# EAGLE design WiFiRadio (EAGLE 9.4.2)
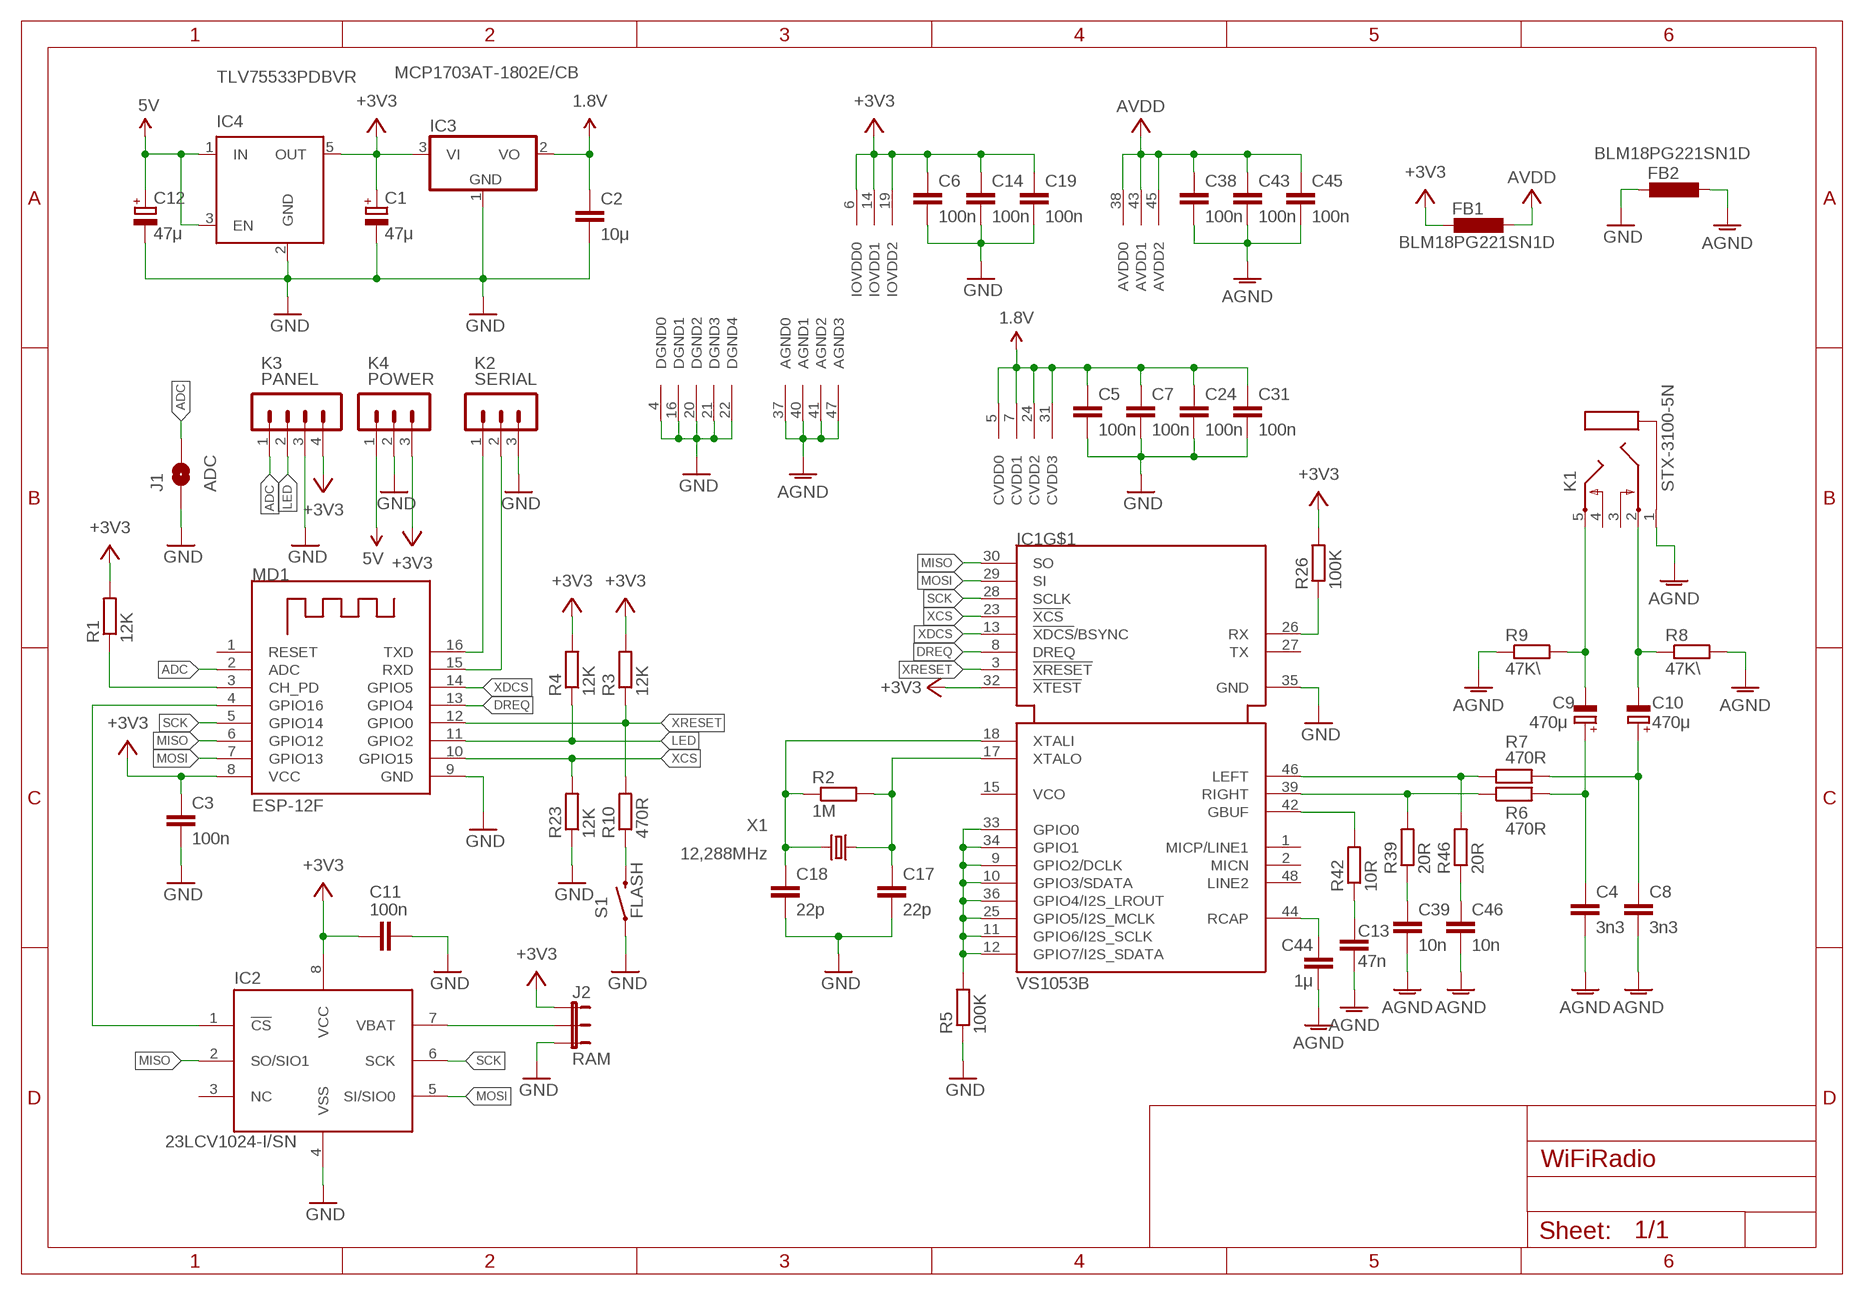
[diagram p0: schematic, sheet 1]

## Parts
C1  47μ  CPOL-EUSMCB  [SMC_B]
C2  10μ  C-EUC0805  [C0805]
C3  100n  C-EUC0603  [C0603]
C4  3n3  C-EUC0805  [C0805]
C5  100n  C-EUC0603  [C0603]
C6  100n  C-EUC0603  [C0603]
C7  100n  C-EUC0603  [C0603]
C8  3n3  C-EUC0805  [C0805]
C9  470μ  CPOL-EUE3.5-8  [E3,5-8]
C10  470μ  CPOL-EUE3.5-8  [E3,5-8]
C11  100n  C-EUC0603  [C0603]
C12  47μ  CPOL-EUSMCB  [SMC_B]
C13  47n  C-EUC0805  [C0805]
C14  100n  C-EUC0603  [C0603]
C17  22p  C-EUC0805  [C0805]
C18  22p  C-EUC0805  [C0805]
C19  100n  C-EUC0603  [C0603]
C24  100n  C-EUC0603  [C0603]
C31  100n  C-EUC0603  [C0603]
C38  100n  C-EUC0603  [C0603]
C39  10n  C-EUC0805  [C0805]
C43  100n  C-EUC0603  [C0603]
C44  1μ  C-EUC0805  [C0805]
C45  100n  C-EUC0603  [C0603]
C46  10n  C-EUC0805  [C0805]
FB1  BLM18PG221SN1D  L-EUL2012C  [L2012C]
FB2  BLM18PG221SN1D  L-EUL2012C  [L2012C]
IC1  VS1053B  [LQFP48]
IC2  23LCV1024-I/SN  [SO-08]
IC3  MCP1703AT-1802E/CB  MCP1703CB  [SOT23]
IC4  TLV75533PDBVR  TLV7555P-DBV  [SOT23-5]
J1  ADC  SOLDERJUMPER-OLDNC  [SJ_2S]
J2  RAM  JUMPER-3SMD  [SJ_3]
K1  STX-3100-5N  STEREOJACK  [STX3100]
K2  SERIAL  MA03-1  [MA03-1]
K3  PANEL  MA04-1  [MA04-1]
K4  POWER  MA03-1  [MA03-1]
MD1  ESP-12F  [ESP-12F]
R1  12K  R-EU_R0805  [R0805]
R2  1M  R-EU_R0805  [R0805]
R3  12K  R-EU_R0805  [R0805]
R4  12K  R-EU_R0805  [R0805]
R5  100K  R-EU_R0805  [R0805]
R6  470R  R-EU_R0805  [R0805]
R7  470R  R-EU_R0805  [R0805]
R8  47K\  R-EU_R0805  [R0805]
R9  47K\  R-EU_R0805  [R0805]
R10  470R  R-EU_R0805  [R0805]
R23  12K  R-EU_R0805  [R0805]
R26  100K  R-EU_R0805  [R0805]
R39  20R  R-EU_R0805  [R0805]
R42  10R  R-EU_R0805  [R0805]
R46  20R  R-EU_R0805  [R0805]
S1  FLASH  SWITCH-MOMENTARY-2SMD  [TACTILE-SWITCH-SMD]
X1  12,288MHz  CRYSTALHC49S  [HC49/S]

## Nets
1.8V: C2.1 C5.1 C7.1 C24.1 C31.1 IC1.5(CVDD0) IC1.7(CVDD1) IC1.24(CVDD2) IC1.31(CVDD3) IC3.2(VO)
5V: C12.+ IC4.1(IN) IC4.3(EN) K4.1
+3V3: C1.+ C3.1 C6.1 C11.1 C14.1 C19.1 FB1.2 IC1.6(IOVDD0) IC1.14(IOVDD1) IC1.19(IOVDD2) IC1.32(!XTEST) IC2.8(VCC) IC3.3(VI) IC4.5(OUT) J2.1 K3.4 K4.3 MD1.8(VCC) R1.2 R3.2 R4.2 R26.2
ADC: J1.2 K3.1 MD1.2(ADC)
AGND: C4.2 C8.2 C13.2 C38.2 C39.2 C43.2 C44.2 C45.2 C46.2 FB2.1 IC1.37(AGND0) IC1.40(AGND1) IC1.41(AGND2) IC1.47(AGND3) K1.1 R8.2 R9.1
DREQ: IC1.8(DREQ) MD1.13(GPIO4)
GND: C1.- C2.2 C3.2 C5.2 C6.2 C7.2 C11.2 C12.- C14.2 C17.2 C18.2 C19.2 C24.2 C31.2 FB2.2 IC1.4(DGND0) IC1.16(DGND1) IC1.20(DGND2) IC1.21(DGND3) IC1.22(DGND4) IC1.35(GND) IC2.4(VSS) IC3.1(GND) IC4.2(GND) J1.1 J2.3 K2.3 K3.3 K4.2 MD1.9(GND) R5.1 R23.1 S1.1
GPIO: IC1.9(GPIO2/DCLK) IC1.10(GPIO3/SDATA) IC1.11(GPIO6/I2S_SCLK) IC1.12(GPIO7/I2S_SDATA) IC1.25(GPIO5/I2S_MCLK) IC1.33(GPIO0) IC1.34(GPIO1) IC1.36(GPIO4/I2S_LROUT) R5.2
LED: K3.2 MD1.11(GPIO2) R4.1
LEFT: IC1.46(LEFT) R7.1 R46.2
MISO: IC1.30(SO) IC2.2(SO/SIO1) MD1.6(GPIO12)
MOSI: IC1.29(SI) IC2.5(SI/SIO0) MD1.7(GPIO13)
N$1: IC2.1(!CS) MD1.4(GPIO16)
N$2: MD1.3(CH_PD) R1.1
N$4: C17.1 IC1.17(XTALO) R2.2 X1.1
N$5: C18.1 IC1.18(XTALI) R2.1 X1.2
N$6: IC1.42(GBUF) R42.2
N$7: C4.1 C9.+ R6.2
N$8: C8.1 C10.+ R7.2
N$9: IC2.7(VBAT) J2.2
N$10: C39.1 R39.1
N$11: C46.1 R46.1
N$12: C13.1 R42.1
N$14: C9.- K1.5 R9.2
N$15: C10.- K1.2 R8.1
N$18: R10.1 S1.3
RCAP: C44.1 IC1.44(RCAP)
RIGHT: IC1.39(RIGHT) R6.1 R39.2
RX: IC1.26(RX) R26.1
RXD: K2.2 MD1.15(RXD)
SCK: IC1.28(SCLK) IC2.6(SCK) MD1.5(GPIO14)
TXD: K2.1 MD1.16(TXD)
V+: C38.1 C43.1 C45.1 FB1.1 IC1.38(AVDD0) IC1.43(AVDD1) IC1.45(AVDD2) ; supply symbol labelled AVDD
XCS: IC1.23(!XCS) MD1.10(GPIO15) R23.2
XDCS: IC1.13(!XDCS!/BSYNC) MD1.14(GPIO5)
XRESET: IC1.3(!XRESET) MD1.12(GPIO0) R3.1 R10.2
Unconnected: IC1.1(MICP/LINE1) IC1.2(MICN) IC1.15(VCO) IC1.27(TX) IC1.48(LINE2) IC2.3(NC) K1.3 K1.4 MD1.1(RESET)

## Library data of the parts
C1 C12 = rcl:CPOL-EU: POLARIZED CAPACITOR, European symbol; SPICEPREFIX: C
C2-C8 C11 C13 C14 C17-C19 C24 C31 C38 C39 C43-C46 = rcl:C-EU: CAPACITOR, European symbol
C9 C10 = rcl:CPOL-EU: POLARIZED CAPACITOR, European symbol
FB1 FB2 = rcl:L-EU: INDUCTOR, European symbol
IC1 = VS1053b:VS1053B: VS1053b VS1053b is an Ogg Vorbis/MP3/AAC/WMA/ FLAC/WAVMIDI audio decoder as well as an PCM/IMA ADPCM/Ogg Vorbis encoder on a single chip. It contains a high-performance, proprietary low-power DSP processor core VS_DSP4, data memory, 16 KiB instruction RAM and 0.5+ KiB data RAM for user appli- cationsrunningsimultaneouslywithanybuilt- in decoder, serial control and input data in- terfaces, upto 8 general purpose I/O pins, an UART, as well as a high-quality variable-sample- rate stereo ADC (mic, line, line + mic or 2×line) and stereo DAC, followed by an earphone am- plifier and a common voltage buffer.
IC2 = 23LCV1024:23LCV1024: 1 Mbit SPI Serial SRAM with Battery Backup and SDI Interface
IC3 = linear:MCP1703: 250 mA, 16V, Low Quiescent Current LDO Regulator Source: http://ww1.microchip.com/downloads/en/DeviceDoc/22049b.pdf
IC4 = Saltech-ics:TLV7555P
J1 = SparkFun-Retired:SOLDERJUMPER-OLD: Solder Jumper Standard SMD solder jumper. Used to automate production. Two varients : Normally Open and Normally Closed are the same, but have different paste layers. NC will have a large amount of paste and should jumper during reflow.
J2 = SparkFun-Retired:JUMPER-3
K1 = adafruit:STEREOJACK: MIC/HEADPHONE JACK Stereo jack with two switches. Kycon STX3100, CUI SJ1-3555NG and/or 4UCon 05544
K2 K4 = con-lstb:MA03-1: PIN HEADER; OC_FARNELL: unknown; OC_NEWARK: unknown
K3 = con-lstb:MA04-1: PIN HEADER; OC_FARNELL: unknown; OC_NEWARK: unknown
MD1 = ESP-12F:ESP-12F
R1-R10 R23 R26 R39 R42 R46 = rcl:R-EU_: RESISTOR, European symbol
S1 = SparkFun-Electromechanical:SWITCH-MOMENTARY-2: Various NO switches- pushbuttons, reed, etc; PROD_ID: SWCH-08247
X1 = crystal:CRYSTAL: CRYSTAL; OC_FARNELL: 1667008; OC_NEWARK: unknown

## Board
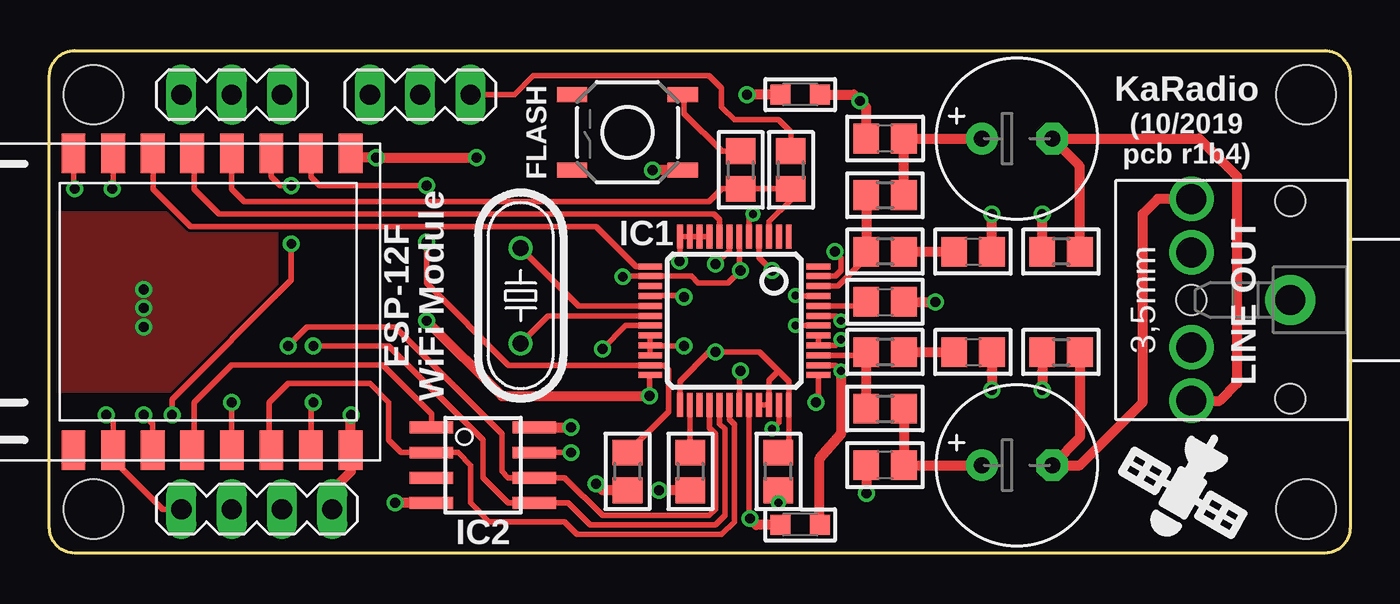
[diagram p1: board, top side]
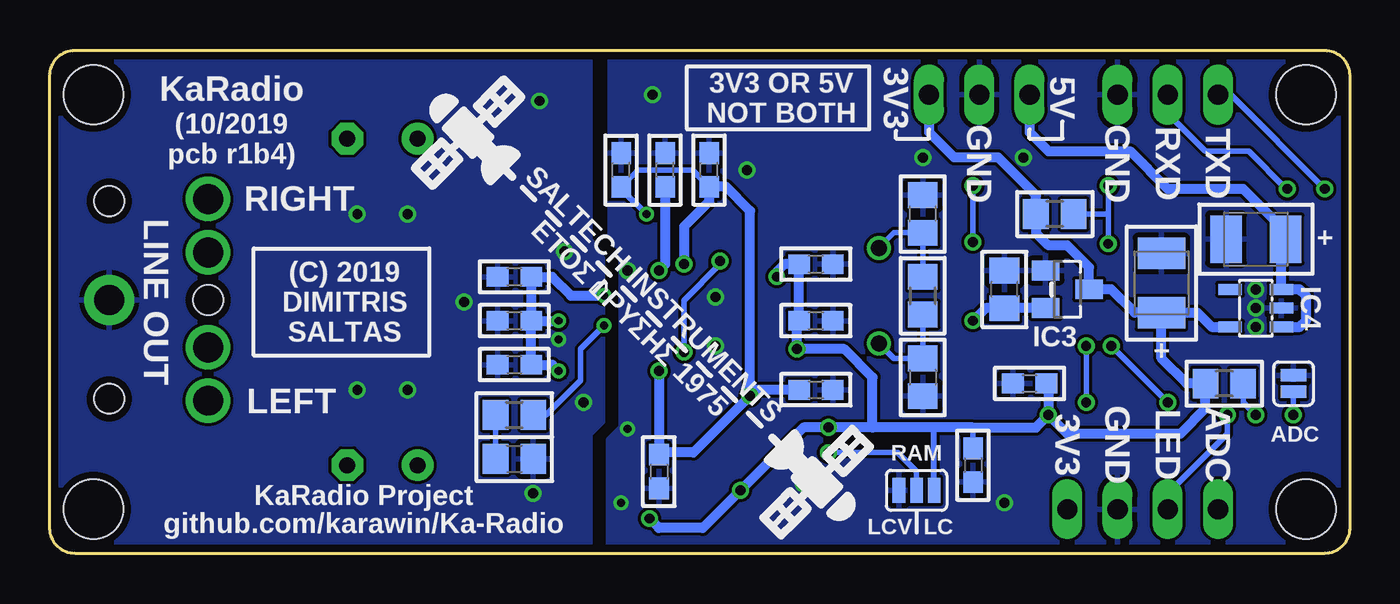
[diagram p2: board, bottom side, seen from below]

Size 65.72 x 25.4 mm. Coordinates in mm from the lower left corner, seen from the top.
Outline: 1.27,25.4 64.45,25.4 arc-90 65.72,24.13 65.72,1.27 arc-90 64.45,0 1.27,0 arc-90 0,1.27 0,24.13 arc-90 1.27,25.4
Copper layers (1*16): Top 0.0356mm / dielectric 1.5011mm / Bottom 0.0356mm
Design rules "oshpark-2layer *": minimum track width 6mil, minimum drill 13mil, track to track 6mil, track to pad 6mil, pad to pad 6mil, via to via 6mil, smd to smd 6mil, copper to edge 15mil, drill to drill 6mil, minimum pad ring 7mil, minimum via ring 7mil, stop-mask expansion 2.5mil, vias tented up to drill 20mil, thermal gap 10mil
Holes 3 mm at 63.5,23.18 63.5,2.22 2.22,23.18 2.22,2.22

### Footprints (pad centres in the part's own frame; a part is rotated, then mirrored left to right if it is on the bottom)
SMC_B = smd 1.6 x 2.4: + -1.5,0; - 1.5,0
C0805 = smd 1.3 x 1.5: 1 -0.95,0; 2 0.95,0
C0603 = smd 1.1 x 1: 1 -0.85,0; 2 0.85,0
E3,5-8 = drill 0.813 pad 1.6: + -1.778,0 | drill 0.813 pad 1.6 octagon: - 1.778,0
L2012C = smd 1 x 1: 1 -1,0; 2 1,0
LQFP48 = smd 0.3 x 1.2: 1 -2.75,-4.25; 2 -2.25,-4.25; 3 -1.75,-4.25; 4 -1.25,-4.25; 5 -0.75,-4.25; 6 -0.25,-4.25; 7 0.25,-4.25; 8 0.75,-4.25; 9 1.25,-4.25; 10 1.75,-4.25; 11 2.25,-4.25; 12 2.75,-4.25; 25 2.75,4.25; 26 2.25,4.25; 27 1.75,4.25; 28 1.25,4.25; 29 0.75,4.25; 30 0.25,4.25; 31 -0.25,4.25; 32 -0.75,4.25; 33 -1.25,4.25; 34 -1.75,4.25; 35 -2.25,4.25; 36 -2.75,4.25 | smd 1.2 x 0.3: 13 4.25,-2.75; 14 4.25,-2.25; 15 4.25,-1.75; 16 4.25,-1.25; 17 4.25,-0.75; 18 4.25,-0.25; 19 4.25,0.25; 20 4.25,0.75; 21 4.25,1.25; 22 4.25,1.75; 23 4.25,2.25; 24 4.25,2.75; 37 -4.25,2.75; 38 -4.25,2.25; 39 -4.25,1.75; 40 -4.25,1.25; 41 -4.25,0.75; 42 -4.25,0.25; 43 -4.25,-0.25; 44 -4.25,-0.75; 45 -4.25,-1.25; 46 -4.25,-1.75; 47 -4.25,-2.25; 48 -4.25,-2.75
SO-08 = smd 0.6 x 2.2: 1 -1.905,-2.6; 2 -0.635,-2.6; 3 0.635,-2.6; 4 1.905,-2.6; 5 1.905,2.6; 6 0.635,2.6; 7 -0.635,2.6; 8 -1.905,2.6
SOT23 = smd 1 x 1.4: 1 -0.95,-1.1; 2 0.95,-1.1; 3 0,1.1
SOT23-5 = smd 0.55 x 1.2: 1 -0.95,-1.3; 2 0,-1.3; 3 0.95,-1.3; 4 0.95,1.3; 5 -0.95,1.3
SJ_2S = smd 0.635 x 1.27: 1 -0.412,0; 2 0.412,0
SJ_3 = smd 0.635 x 1.27: 1 -0.889,0; 2 0,0; 3 0.889,0
STX3100 = drill 1.5 pad 2.54: 1 2.7,-0.1 | drill 1.5: 2 7.7,5; 3 7.7,2.3; 4 7.7,-2.5; 5 7.7,-5.2 | hole 1.5: 2.7,4.9; 2.7,-5.1; 7.7,-0.1
MA03-1 = drill 1.016 long: 1 -2.54,0; 2 0,0; 3 2.54,0
MA04-1 = drill 1.016 long: 1 -3.81,0; 2 -1.27,0; 3 1.27,0; 4 3.81,0
ESP-12F = smd 2 x 1.2: 1 -7.5,4.5; 2 -7.5,2.5; 3 -7.5,0.5; 4 -7.5,-1.5; 5 -7.5,-3.5; 6 -7.5,-5.5; 7 -7.5,-7.5; 8 -7.5,-9.5; 9 7.5,-9.5; 10 7.5,-7.5; 11 7.5,-5.5; 12 7.5,-3.5; 13 7.5,-1.5; 14 7.5,0.5; 15 7.5,2.5; 16 7.5,4.5
R0805 = smd 1.3 x 1.5: 1 -0.95,0; 2 0.95,0
TACTILE-SWITCH-SMD = smd 1.524 x 0.762: 1 -2.794,1.905; 2 2.794,1.905; 3 -2.794,-1.905; 4 2.794,-1.905
HC49/S = drill 0.813: 1 -2.413,0; 2 2.413,0

### Placement (x,y rotation side)
C1  9.53,13.65 90 bottom
C2  17.46,13.34 90 bottom
C3  16.19,8.57 180 bottom
C4  42.23,4.45 180 top
C5  36.83,19.37 90 bottom
C6  34.61,19.37 90 bottom
C7  32.38,19.37 90 bottom
C8  42.23,20.96 180 top
C9  48.9,4.45 0 top
C10  48.9,20.96 0 top
C11  19.05,4.45 270 bottom
C12  4.76,15.88 180 bottom
C13  42.23,4.76 0 bottom
C14  26.99,14.61 0 bottom
C17  21.59,17.14 90 bottom
C18  21.59,8.89 270 bottom
C19  26.99,11.75 0 bottom
C24  26.99,8.26 0 bottom
C31  34.93,4.13 270 bottom
C38  42.23,13.97 180 bottom
C39  46.67,10.16 0 top
C43  42.23,9.53 180 bottom
C44  42.23,12.7 0 top
C45  42.23,11.75 180 bottom
C46  46.67,15.24 0 top
FB1  37.94,1.43 180 top
FB2  37.94,23.18 180 top
IC1  34.61,11.75 180 top
IC2  21.91,4.45 270 top
IC3  14.29,13.34 270 bottom
IC4  4.76,12.38 90 bottom
J1  2.86,8.57 270 bottom
J2  21.91,3.18 180 bottom
K1  65.41,12.7 180 top
K2  9.21,23.18 0 top
K3  10.48,2.22 0 top
K4  18.73,23.18 0 top
MD1  5.71,12.7 90 top
R1  6.35,8.57 180 bottom
R2  21.59,13.02 90 bottom
R3  37.47,19.37 90 top
R4  14.92,17.14 180 bottom
R5  36.83,4.13 90 top
R6  42.23,7.3 0 top
R7  42.23,18.1 0 top
R8  51.12,15.24 180 top
R9  51.12,10.16 0 top
R10  34.93,19.37 270 top
R23  29.21,4.13 90 top
R26  32.38,4.13 270 top
R39  42.23,10.16 180 top
R42  42.23,6.99 0 bottom
R46  42.23,15.24 180 top
S1  29.21,21.27 180 top
X1  23.81,13.02 270 top

### Tracks (layer width: path | path; a pad name or v marks a point on that pad's centre or on a via)
1.8V  (via drill 0.4, 0.5)
  Top 0.279: IC1.31 34.86,9.14 v34.93,9.21 | IC1.5 35.36,16.94 v35.56,17.14 | v30.32,7.94 30.32,8.96 IC1.24 | IC1.7 34.36,15.31 v33.66,14.61
  Top 0.508: v19.05,11.75 22.86,7.94 v30.32,7.94
  Bottom 0.279: 34.92,5.08 C31.1 | C7.1 33.23,19.37 35.98,19.37 C5.1 36.83,18.41 v35.56,17.14 | 30,8.26 v30.32,7.94
  Bottom 0.508: v34.93,9.21 C31.1 | 34.92,5.08 33.18,5.08 v30.32,7.94 30.32,17.3 31.54,18.52 C7.1 32.38,17.78 33.66,16.51 v33.66,14.61 | C24.1 30,8.26 | IC3.2 C2.1 18.41,12.38 v19.05,11.75
5V
  Bottom 0.279: IC4.3 | 3.46,15.68 C12.+ 3.26,16.28
  Bottom 0.508: K4.1 16.19,21.27 15.24,20.32 11.11,20.32 9.21,18.41 5.4,18.41 3.26,16.28 | IC4.1 2.54,11.43 2.22,11.75 2.22,13.02 2.54,13.34 IC4.3 | IC4.3 3.46,15.68
+3V3  (via drill 0.5)
  Top 0.279: IC1.6 34.86,14.36 v34.93,14.29 34.29,13.65 32.78,13.65 32.44,14 IC1.14 29,14 v28.97,13.97 | R26.2 | IC1.19 29.12,11.5 v27.94,10.32 | IC1.32 35.36,1.79 v35.4,1.75 | 15.24,5.18 MD1.8 | K4.3 23.49,23.18 24.45,24.13 33.34,24.13 33.97,23.5 33.97,22.54 34.61,21.91 36.83,21.91 37.47,21.27 R3.2
  Top 0.508: MD1.8 15.21,6.96 v15.24,6.99 | IC2.8 v26.35,6.35 | R26.2 v30.8,3.18 | FB1.2 35.72,1.43 v35.4,1.75 | K3.4 14.29,3.18 15.24,4.13 15.24,5.18
  Bottom 0.279: 15.24,8.57 C3.1 | R1.2 | C11.1 19.05,6.35 | R4.2
  Bottom 0.305: J2.1 21.02,6.35
  Bottom 0.508: 24.13,6.35 24.13,8.89 25.56,10.32 v27.94,10.32 27.94,11.64 C19.1 C14.1 28.58,14.61 28.97,14.21 v28.97,13.97 | 15.24,8.57 v15.24,6.99 | v15.24,6.99 15.87,6.35 19.05,6.35 21.02,6.35 24.13,6.35 | 24.13,6.35 v26.35,6.35 27.62,6.35 v30.8,3.18 32.7,1.27 34.93,1.27 v35.4,1.75 | C6.1 34.61,14.61 v34.93,14.29 | R1.2 7.3,7.3 8.57,6.03 14.29,6.03 v15.24,6.99 | IC4.5 6.99,11.43 7.71,12.15 C1.+ | R1.2 8.26,8.57 9.53,9.84 C1.+ | C1.+ 10.88,12.15 12.07,13.34 IC3.3 13.19,14.46 14.29,15.56 15.24,15.56 15.87,16.19 R4.2 | K4.3 21.27,21.27 20,20 17.78,20 15.87,18.09 R4.2
ADC  (via drill 0.5)
  Top 0.279: K3.1 5.71,2.22 3.22,4.72 MD1.2 3.22,6.63 v2.86,6.99
  Bottom 0.279: J1.2 v2.86,6.99
AGND  (via drill 0.4, 0.5)
  Top 0.279: IC1.41 IC1.40 39.71,10.5 v40.01,10.79 | v38.73,7.62 38.86,7.82 IC1.37 | IC1.47 39.72,14 40.01,14.29 40.01,14.92 v39.69,15.24 | v41.28,3.02 v41.27,3.02
  Top 0.508: R8.2 50.17,16.2 v50.16,17.14 | R9.1 50.17,9.21 v50.16,8.26 | C46.2 47.62,16.2 v47.62,17.14 | C39.2 47.62,9.21 v47.62,8.26 | C44.2 v44.77,12.7 | C4.2 v41.28,3.02 | FB2.1 40.64,23.18 v40.96,22.86 41.28,22.54 C8.2
  pour Bottom: 38.42,25.88 38.42,15.88 37.78,14.92 37.78,6.67 38.42,6.03 38.42,-0.32 66.04,-0.32 66.04,26.04
DREQ
  Top 0.279: MD1.13 7.3,20.11 7.3,18.41 8.57,17.14 33.58,17.14 33.86,16.86 IC1.8
GND  (via drill 0.4, 0.5)
  Top 0.279: IC1.22 IC1.21 | IC1.21 IC1.20 | v32.07,10.48 30.38,10.48 IC1.21 | IC1.35 36.86,6.62 v36.51,6.27 | IC1.4 35.86,14.94 v36.51,14.29 | R5.1 v36.83,2.54 | IC1.16 30.38,13.02 31.99,13.02 arc-90 v32.07,12.94 | 15.41,20 MD1.9
  Top 0.508: FB2.2 v35.24,23.18 | IC2.4 v17.46,2.54 | R23.1 27.94,3.18 v27.62,3.49 | 15.41,20 v16.51,20 v21.59,20 | S1.1 v30.48,19.37
  other vias: 4.76,12.38 4.76,13.34 4.76,11.43
  pour Bottom: 37.39,25.72 37.39,16.03 36.83,15.24 36.83,6.35 37.47,5.71 37.47,-0.32 -0.32,-0.32 -0.32,25.72
  pour Top: -0.32,17.14 11.43,17.14 11.43,8.26 -0.32,8.26
GPIO  (via drill 0.5)
  Top 0.279: R5.2 37.36,5.29 IC1.36 37.36,8.68 36.83,9.21 | IC1.33 IC1.34 36.36,8.74 36.83,9.21 | IC1.9 IC1.10 IC1.11 IC1.12 31.86,14.79 v31.83,14.76 | IC1.25 31.86,8.68 33.34,10.16 v33.66,10.16 35.88,10.16 36.83,9.21
  Bottom 0.279: v33.66,10.16 33.66,12.78 31.83,14.61 v31.83,14.76
LED  (via drill 0.5)
  Top 0.279: v6.19,6.99 6.19,7.78 12.22,13.81 v12.22,15.64 | MD1.11 11.21,19.03 11.67,18.57 v12.22,18.57
  Bottom 0.279: K3.2 9.21,3.02 6.19,6.03 v6.19,6.99 | v12.22,18.57 12.22,17.14 | 12.22,17.14 v12.22,15.64 | R4.1 12.22,17.14
LEFT
  Top 0.279: IC1.46 39.85,13.5 40.96,14.61 40.96,14.92 R46.2
  Top 0.508: R7.1 R46.2
MISO
  Top 0.279: IC1.30 34.36,6.76 34.61,6.51 34.61,1.59 33.97,0.95 26.67,0.95 26.04,1.59 22.23,1.59 21.27,2.54 21.27,4.45 20.64,5.08 IC2.2 17.78,5.08 17.14,5.71 17.14,7.62 16.19,8.57 12.07,8.57 11.11,7.62 11.11,5.3 MD1.6
MOSI  (via drill 0.5)
  Top 0.279: IC1.29 33.86,6.54 34.13,6.27 34.13,1.9 33.66,1.43 27.3,1.43 26.19,2.54 IC2.5 23.18,2.54 21.91,3.81 21.91,5.71 17.14,10.48 v13.33,10.48 | MD1.7 13.21,7.5 v13.33,7.62
  Bottom 0.279: v13.33,7.62 v13.33,10.48
N$1
  Top 0.279: IC2.1 19.31,7.04 16.83,9.53 9.21,9.53 7.3,7.62 7.3,5.29 MD1.4
N$2  (via drill 0.5)
  Top 0.279: MD1.3 5.22,6.53 v4.76,6.99
  Bottom 0.279: v4.76,6.99 5.4,7.62 R1.1
N$4
  Top 0.279: IC1.17 26.75,12.5 X1.1
  Bottom 0.279: X1.1 23.05,16.2 C17.1 R2.2
N$5
  Top 0.279: IC1.18 25.21,12 X1.2
  Bottom 0.279: X1.2 23.05,9.84 C18.1 R2.1
N$6  (via drill 0.4)
  Top 0.279: IC1.42 37.73,11.5 37.71,11.51 v37.7,11.51
  Bottom 0.279: v37.7,11.51 38.89,10.32 38.89,8.73 40.64,6.99 R42.2
N$7
  Top 0.508: R6.2 C4.1 C9.+
N$8
  Top 0.508: R7.2 C8.1 C10.+
N$9  (via drill 0.5)
  Top 0.279: IC2.7 v26.35,5.08
  Bottom 0.279: v26.35,5.08 22.86,5.08 21.91,4.13 J2.2
N$10
  Top 0.508: R39.1 C39.1
N$11
  Top 0.508: R46.1 C46.1
N$12
  Bottom 0.279: C13.1 R42.1
N$14
  Top 0.508: K1.5 56,17.9 55.24,17.14 55.24,7.62 52.07,4.45 C9.- 52.07,5.84 R9.2
N$15
  Top 0.508: K1.2 59.13,7.7 60.01,8.57 60.01,19.05 58.1,20.96 C10.- 52.07,19.56 R8.1
N$18
  Top 0.279: R10.1 33.98,20.32 32.07,22.23 32.07,23.11 S1.3
RCAP
  Top 0.279: IC1.44 41.08,12.5 C44.1
RIGHT
  Top 0.279: IC1.39 41.12,10 R39.2
  Top 0.508: R6.1 R39.2
RX
  Top 0.279: IC1.26 32.36,5.11 R26.1
RXD  (via drill 0.5)
  Top 0.279: MD1.15 3.22,18.46 v3.17,18.41
  Bottom 0.279: v3.17,18.41 3.22,18.41 5.12,20.32 7.3,20.32 9.21,22.23 K2.2
SCK  (via drill 0.5)
  Top 0.279: IC1.28 33.36,6.33 33.66,6.03 33.66,2.22 33.34,1.9 27.94,1.9 26.04,3.81 IC2.6 23.18,3.81 22.86,4.13 22.86,6.03 17.46,11.43 13.02,11.43 v12.07,10.48 | MD1.5 9.21,7.61 v9.21,7.62
  Bottom 0.279: v12.07,10.48 v9.21,7.62
TXD  (via drill 0.5)
  Top 0.279: MD1.16 1.22,18.47 v1.27,18.41
  Bottom 0.279: v1.27,18.41 6.03,23.18 K2.1
V+  (via drill 0.4)
  Top 0.279: IC1.38 39.72,9.5 v40.01,9.21 | v40.01,11.75 39.76,12 IC1.43 | v37.7,13.02 37.8,13 IC1.45 | 38.89,1.48 FB1.1
  Top 0.508: v40.01,9.21 40.01,6.03 38.89,4.76 38.89,1.48
  Bottom 0.508: C45.1 C43.1 40.32,9.53 v40.01,9.21 | C45.1 C38.1 40.32,13.97 39.37,13.02 v37.7,13.02 | C45.1 v40.01,11.75
XCS  (via drill 0.5)
  Top 0.279: R23.2 31.27,7.14 31.27,9.29 31.06,9.5 IC1.23 23.2,9.5 19.05,13.65 v19.05,15.72 | v19.05,18.57 13.65,18.57 13.21,19.01 MD1.10
  Bottom 0.279: v19.05,15.72 v19.05,18.57
XDCS
  Top 0.279: IC1.13 29.63,14.5 27.62,16.51 7.14,16.51 5.24,18.41 5.24,20.18 MD1.14
XRESET
  Top 0.279: IC1.3 36.36,16.75 37.47,17.86 R3.1 R10.2 33.98,18.42 33.34,17.78 9.84,17.78 9.21,18.41 MD1.12

### Text on the board
tPlace: FLASH | ESP-12F / WiFi Module | LINE OUT
bPlace: 5V | 3V3 | 3V3 OR 5V / NOT BOTH | TXD / RXD / GND | GND | RIGHT | + | IC4 | SALTECH INSTRUMENTS / ETOΣ I PYΣHΣ 1975 | LINE OUT | + | IC3 | LEFT | ADC / LED / GND / 3V3
tNames: KaRadio | (10/2019 / pcb r1b4)
bNames: KaRadio | (10/2019 / pcb r1b4) | (C) 2019 / DIMITRIS / SALTAS | ADC | RAM | LC | LCV | KaRadio Project / github.com/karawin/Ka-Radio